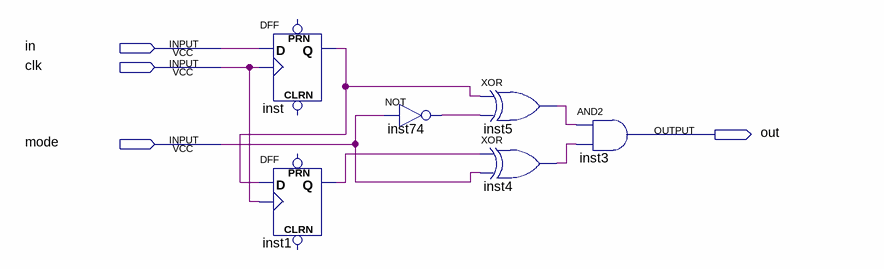
[diagram p0: schematic sheet]
// Quartus schematic pulser.bdf as structural Verilog: 6 symbols, 4 pins
module pulser (
  input  in,
  input  clk,
  input  mode,
  output out
);

  wire inst1_q, inst4_out, inst5_out, inst74_out, inst_q;

  DFF inst (.CLK(clk), .D(in), .Q(inst_q));  // open: CLRN, PRN
  DFF inst1 (.CLK(clk), .D(inst_q), .Q(inst1_q));  // open: CLRN, PRN
  not inst74 (inst74_out, mode);
  xor inst5 (inst5_out, inst_q, inst74_out);
  xor inst4 (inst4_out, inst1_q, mode);
  and inst3 (out, inst5_out, inst4_out);
endmodule
